# EAGLE schematic WithBrian (EAGLE 7.5.0)
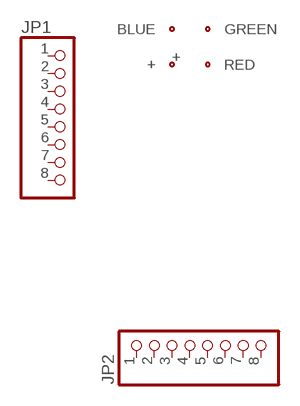
[diagram p0: schematic, sheet 1]

## Parts
JP1  PINHD-1X8BIG  [1X08-BIG]
JP2  PINHD-1X8BIG  [1X08-BIG]
U$1  PILLAR  [PILLAR_PADS]
Unconnected: JP1.1 JP1.2 JP1.3 JP1.4 JP1.5 JP1.6 JP1.7 JP1.8 JP2.1 JP2.2 JP2.3 JP2.4 JP2.5 JP2.6 JP2.7 JP2.8 U$1.+ U$1.BLUE U$1.GREEN U$1.RED

## Library data of the parts
JP1 JP2 = adafruit:PINHD-1X8: PIN HEADER
U$1 = PILLAR:PILLAR